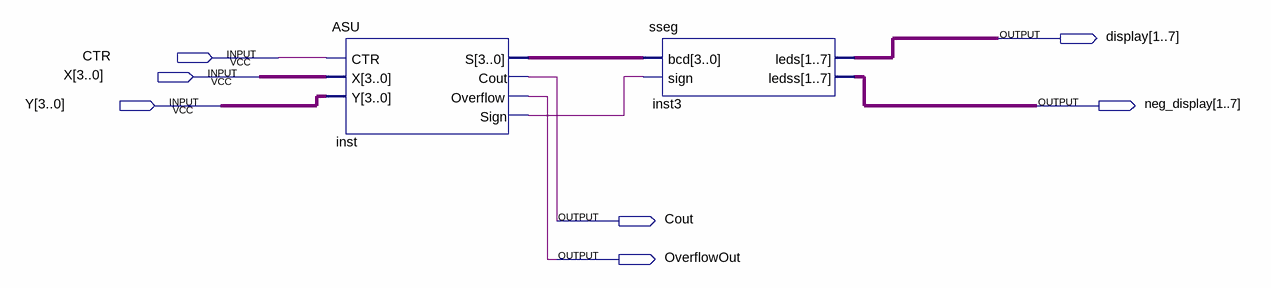
[diagram p0: schematic sheet]
// Quartus schematic CombinedASU1.bdf as structural Verilog: 2 symbols, 7 pins
module CombinedASU1 (
  input  CTR,
  input  [3:0] X,
  input  [3:0] Y,
  output [1:7] display,
  output [1:7] neg_display,
  output Cout,
  output OverflowOut
);

  wire inst_sign;
  wire [3:0] inst_s;

  ASU inst (.CTR(CTR), .X(X), .Y(Y), .S(inst_s), .Cout(Cout), .Overflow(OverflowOut), .Sign(inst_sign));
  sseg inst3 (.bcd(inst_s), .sign(inst_sign), .leds(display), .ledss(neg_display));
endmodule
